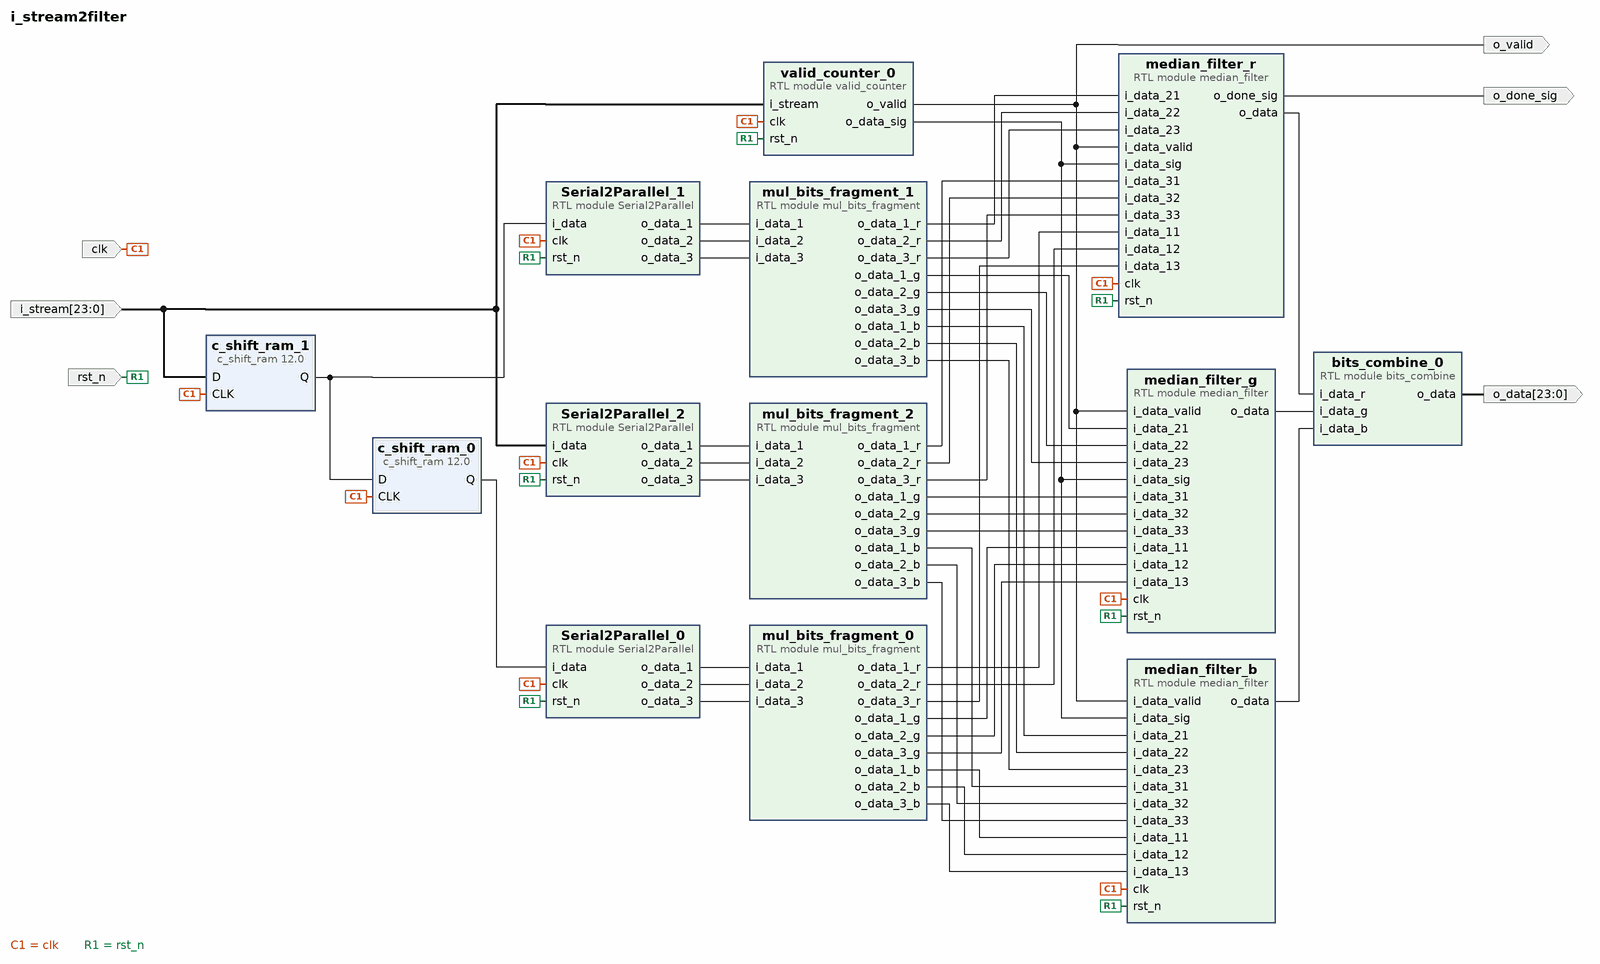
[diagram p0: block diagram of the top level]
# Vivado block design i_stream2filter, xc7z020clg400-2, Vivado 2018.3
create_bd_design i_stream2filter

create_bd_port -dir I -type clk clk
set_property -dict {CONFIG.FREQ_HZ 100000000} [get_bd_ports clk]
create_bd_port -dir I -type rst rst_n
create_bd_port -dir O -from 23 -to 0 o_data
create_bd_port -dir O o_done_sig
create_bd_port -dir O o_valid
create_bd_port -dir I -from 23 -to 0 i_stream

create_bd_cell -type module -reference Serial2Parallel Serial2Parallel_0
set_property -dict {CONFIG.N 24} [get_bd_cells Serial2Parallel_0]
create_bd_cell -type module -reference Serial2Parallel Serial2Parallel_1
set_property -dict {CONFIG.N 24} [get_bd_cells Serial2Parallel_1]
create_bd_cell -type module -reference Serial2Parallel Serial2Parallel_2
set_property -dict {CONFIG.N 24} [get_bd_cells Serial2Parallel_2]
create_bd_cell -type module -reference median_filter median_filter_r
set_property -dict {CONFIG.N 8} [get_bd_cells median_filter_r]
create_bd_cell -type ip -vlnv xilinx.com:ip:c_shift_ram:12.0 c_shift_ram_0
set_property -dict [list \
  CONFIG.AsyncInitVal 000000000000000000000000 \
  CONFIG.DefaultData 000000000000000000000000 \
  CONFIG.Depth 1080 \
  CONFIG.Width 24 \
] [get_bd_cells c_shift_ram_0]
create_bd_cell -type ip -vlnv xilinx.com:ip:c_shift_ram:12.0 c_shift_ram_1
set_property -dict [list \
  CONFIG.AsyncInitVal 000000000000000000000000 \
  CONFIG.DefaultData 000000000000000000000000 \
  CONFIG.Depth 1080 \
  CONFIG.Width 24 \
] [get_bd_cells c_shift_ram_1]
create_bd_cell -type module -reference valid_counter valid_counter_0
set_property -dict {CONFIG.N 24 CONFIG.Pixel_high 720 CONFIG.Pixel_wide 1080} [get_bd_cells valid_counter_0]
create_bd_cell -type module -reference median_filter median_filter_g
set_property -dict {CONFIG.N 8} [get_bd_cells median_filter_g]
create_bd_cell -type module -reference median_filter median_filter_b
set_property -dict {CONFIG.N 8} [get_bd_cells median_filter_b]
create_bd_cell -type module -reference mul_bits_fragment mul_bits_fragment_0
create_bd_cell -type module -reference mul_bits_fragment mul_bits_fragment_1
create_bd_cell -type module -reference mul_bits_fragment mul_bits_fragment_2
create_bd_cell -type module -reference bits_combine bits_combine_0

# ---- connections ----

connect_bd_net [get_bd_ports clk] \
  [get_bd_pins Serial2Parallel_1/clk] [get_bd_pins Serial2Parallel_2/clk] [get_bd_pins Serial2Parallel_0/clk] \
  [get_bd_pins median_filter_r/clk] [get_bd_pins c_shift_ram_1/CLK] [get_bd_pins c_shift_ram_0/CLK] \
  [get_bd_pins valid_counter_0/clk] [get_bd_pins median_filter_g/clk] [get_bd_pins median_filter_b/clk]
connect_bd_net [get_bd_pins valid_counter_0/o_valid] \
  [get_bd_pins median_filter_r/i_data_valid] [get_bd_pins median_filter_g/i_data_valid] \
  [get_bd_pins median_filter_b/i_data_valid] [get_bd_ports o_valid]
connect_bd_net [get_bd_pins valid_counter_0/o_data_sig] \
  [get_bd_pins median_filter_r/i_data_sig] [get_bd_pins median_filter_g/i_data_sig] [get_bd_pins median_filter_b/i_data_sig]
connect_bd_net [get_bd_ports i_stream] [get_bd_pins Serial2Parallel_2/i_data] [get_bd_pins valid_counter_0/i_stream] [get_bd_pins c_shift_ram_1/D]
connect_bd_net [get_bd_ports rst_n] \
  [get_bd_pins Serial2Parallel_0/rst_n] [get_bd_pins Serial2Parallel_1/rst_n] [get_bd_pins Serial2Parallel_2/rst_n] \
  [get_bd_pins median_filter_r/rst_n] [get_bd_pins valid_counter_0/rst_n] [get_bd_pins median_filter_g/rst_n] \
  [get_bd_pins median_filter_b/rst_n]
connect_bd_net [get_bd_pins c_shift_ram_1/Q] [get_bd_pins c_shift_ram_0/D] [get_bd_pins Serial2Parallel_1/i_data]
connect_bd_net [get_bd_pins c_shift_ram_0/Q] [get_bd_pins Serial2Parallel_0/i_data]
connect_bd_net [get_bd_pins Serial2Parallel_0/o_data_1] [get_bd_pins mul_bits_fragment_0/i_data_1]
connect_bd_net [get_bd_pins Serial2Parallel_0/o_data_2] [get_bd_pins mul_bits_fragment_0/i_data_2]
connect_bd_net [get_bd_pins Serial2Parallel_0/o_data_3] [get_bd_pins mul_bits_fragment_0/i_data_3]
connect_bd_net [get_bd_pins mul_bits_fragment_0/o_data_1_r] [get_bd_pins median_filter_r/i_data_11]
connect_bd_net [get_bd_pins mul_bits_fragment_0/o_data_1_g] [get_bd_pins median_filter_g/i_data_11]
connect_bd_net [get_bd_pins mul_bits_fragment_0/o_data_1_b] [get_bd_pins median_filter_b/i_data_11]
connect_bd_net [get_bd_pins mul_bits_fragment_0/o_data_2_r] [get_bd_pins median_filter_r/i_data_12]
connect_bd_net [get_bd_pins mul_bits_fragment_0/o_data_2_g] [get_bd_pins median_filter_g/i_data_12]
connect_bd_net [get_bd_pins mul_bits_fragment_0/o_data_2_b] [get_bd_pins median_filter_b/i_data_12]
connect_bd_net [get_bd_pins mul_bits_fragment_0/o_data_3_r] [get_bd_pins median_filter_r/i_data_13]
connect_bd_net [get_bd_pins mul_bits_fragment_0/o_data_3_g] [get_bd_pins median_filter_g/i_data_13]
connect_bd_net [get_bd_pins mul_bits_fragment_0/o_data_3_b] [get_bd_pins median_filter_b/i_data_13]
connect_bd_net [get_bd_pins Serial2Parallel_1/o_data_1] [get_bd_pins mul_bits_fragment_1/i_data_1]
connect_bd_net [get_bd_pins Serial2Parallel_1/o_data_2] [get_bd_pins mul_bits_fragment_1/i_data_2]
connect_bd_net [get_bd_pins Serial2Parallel_1/o_data_3] [get_bd_pins mul_bits_fragment_1/i_data_3]
connect_bd_net [get_bd_pins mul_bits_fragment_1/o_data_1_r] [get_bd_pins median_filter_r/i_data_21]
connect_bd_net [get_bd_pins mul_bits_fragment_1/o_data_1_g] [get_bd_pins median_filter_g/i_data_21]
connect_bd_net [get_bd_pins mul_bits_fragment_1/o_data_1_b] [get_bd_pins median_filter_b/i_data_21]
connect_bd_net [get_bd_pins mul_bits_fragment_1/o_data_2_r] [get_bd_pins median_filter_r/i_data_22]
connect_bd_net [get_bd_pins mul_bits_fragment_1/o_data_2_g] [get_bd_pins median_filter_g/i_data_22]
connect_bd_net [get_bd_pins mul_bits_fragment_1/o_data_2_b] [get_bd_pins median_filter_b/i_data_22]
connect_bd_net [get_bd_pins mul_bits_fragment_1/o_data_3_r] [get_bd_pins median_filter_r/i_data_23]
connect_bd_net [get_bd_pins mul_bits_fragment_1/o_data_3_g] [get_bd_pins median_filter_g/i_data_23]
connect_bd_net [get_bd_pins mul_bits_fragment_1/o_data_3_b] [get_bd_pins median_filter_b/i_data_23]
connect_bd_net [get_bd_pins Serial2Parallel_2/o_data_1] [get_bd_pins mul_bits_fragment_2/i_data_1]
connect_bd_net [get_bd_pins Serial2Parallel_2/o_data_2] [get_bd_pins mul_bits_fragment_2/i_data_2]
connect_bd_net [get_bd_pins Serial2Parallel_2/o_data_3] [get_bd_pins mul_bits_fragment_2/i_data_3]
connect_bd_net [get_bd_pins mul_bits_fragment_2/o_data_1_r] [get_bd_pins median_filter_r/i_data_31]
connect_bd_net [get_bd_pins mul_bits_fragment_2/o_data_1_g] [get_bd_pins median_filter_g/i_data_31]
connect_bd_net [get_bd_pins mul_bits_fragment_2/o_data_1_b] [get_bd_pins median_filter_b/i_data_31]
connect_bd_net [get_bd_pins mul_bits_fragment_2/o_data_2_r] [get_bd_pins median_filter_r/i_data_32]
connect_bd_net [get_bd_pins mul_bits_fragment_2/o_data_2_g] [get_bd_pins median_filter_g/i_data_32]
connect_bd_net [get_bd_pins mul_bits_fragment_2/o_data_2_b] [get_bd_pins median_filter_b/i_data_32]
connect_bd_net [get_bd_pins mul_bits_fragment_2/o_data_3_r] [get_bd_pins median_filter_r/i_data_33]
connect_bd_net [get_bd_pins mul_bits_fragment_2/o_data_3_g] [get_bd_pins median_filter_g/i_data_33]
connect_bd_net [get_bd_pins mul_bits_fragment_2/o_data_3_b] [get_bd_pins median_filter_b/i_data_33]
connect_bd_net [get_bd_pins median_filter_r/o_data] [get_bd_pins bits_combine_0/i_data_r]
connect_bd_net [get_bd_pins median_filter_g/o_data] [get_bd_pins bits_combine_0/i_data_g]
connect_bd_net [get_bd_pins median_filter_b/o_data] [get_bd_pins bits_combine_0/i_data_b]
connect_bd_net [get_bd_pins bits_combine_0/o_data] [get_bd_ports o_data]
connect_bd_net [get_bd_pins median_filter_r/o_done_sig] [get_bd_ports o_done_sig]

validate_bd_design
save_bd_design
